# Altium schematic sheet MCU-TFCARD.SchDoc
size B
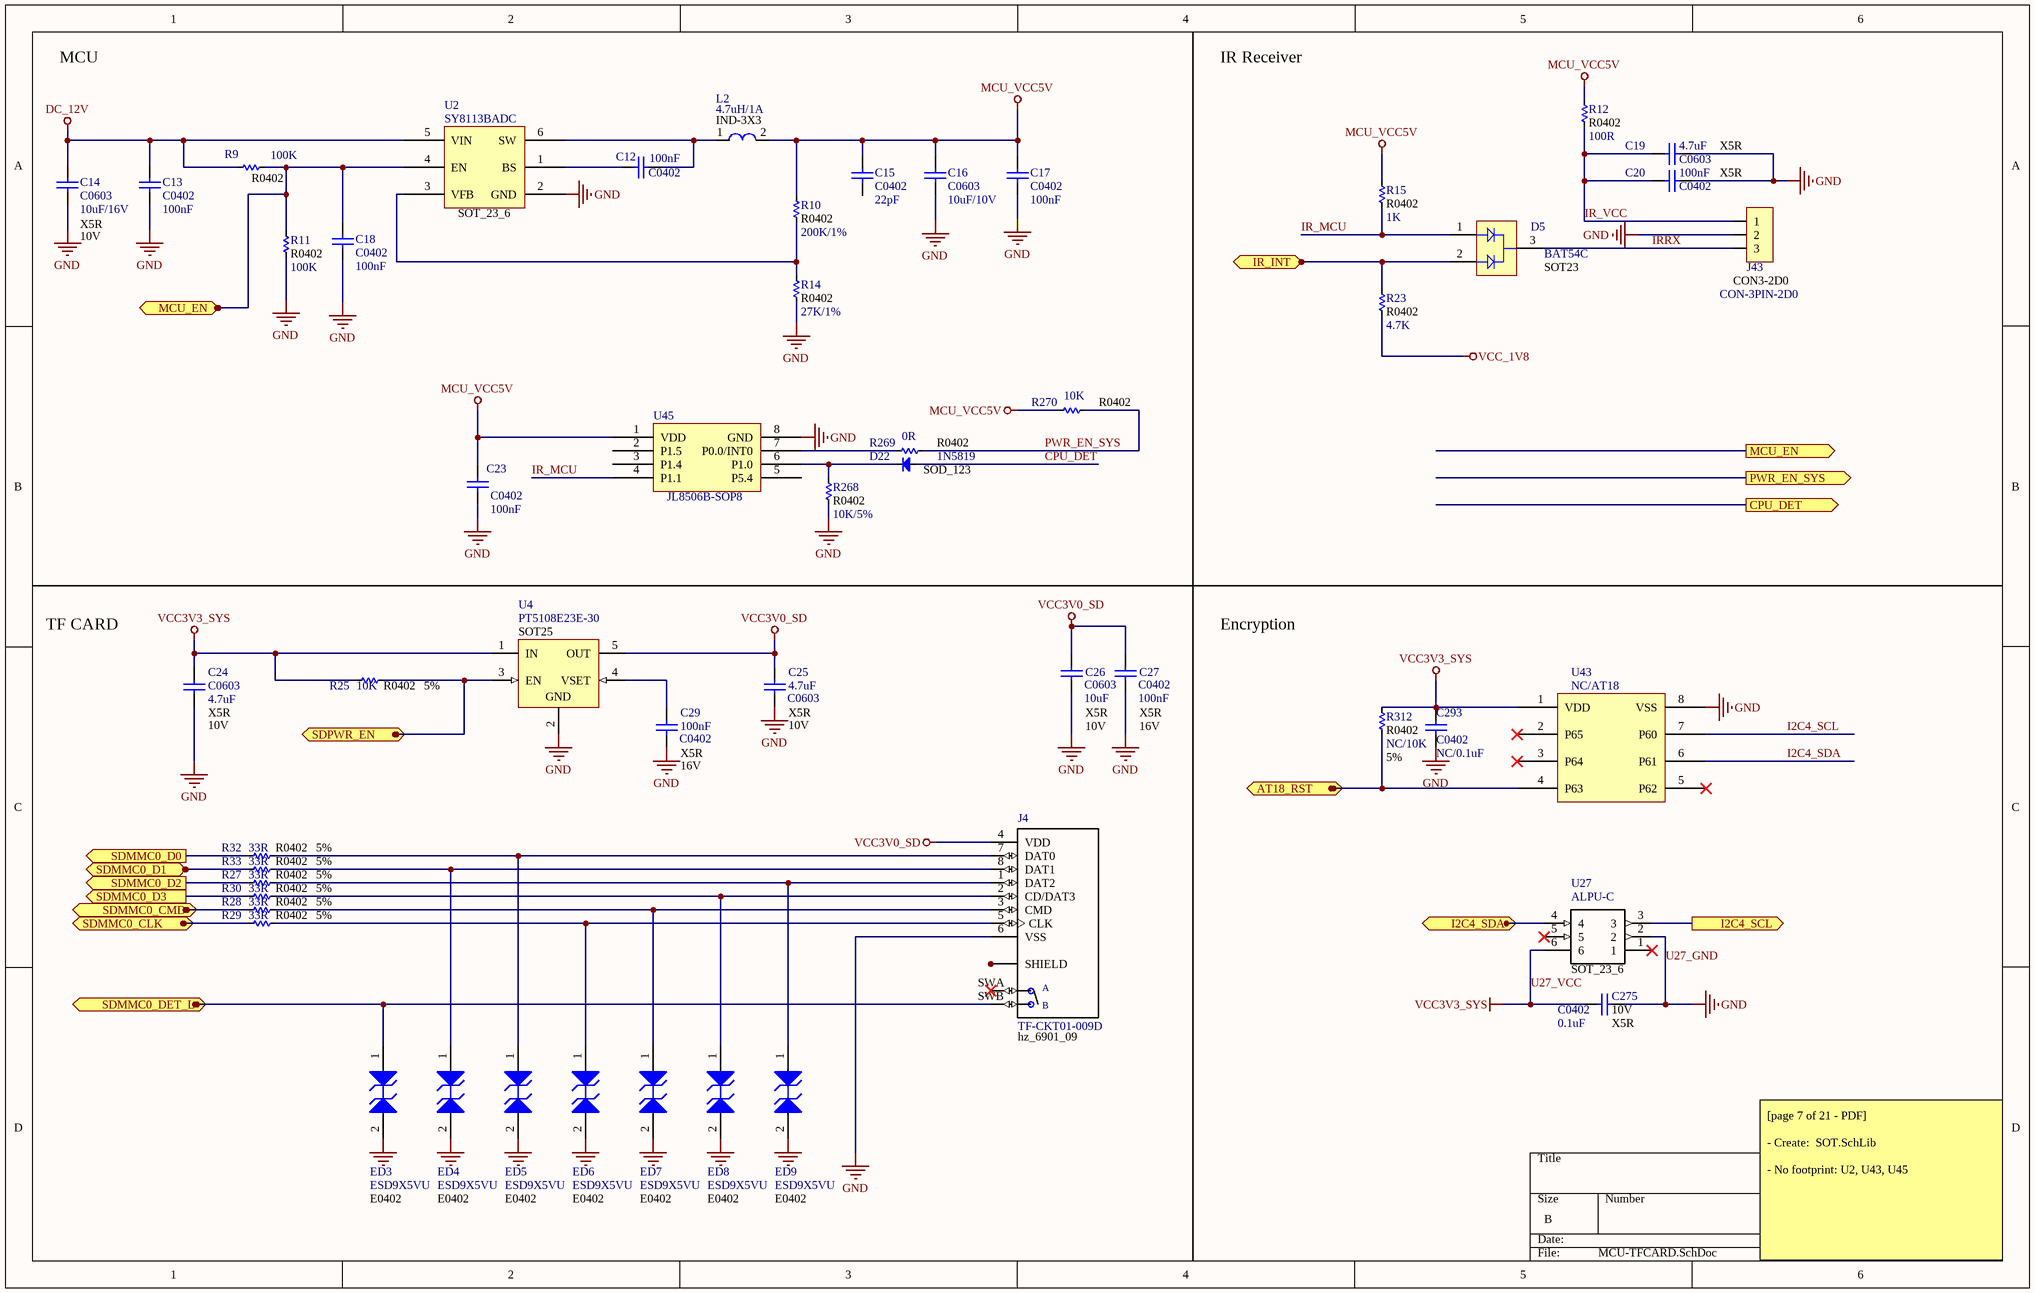
[diagram p0: MCU-TFCARD.SchDoc]

## Parts
C12  C0402  value 100nF  [C 0402]
C13  C0402  value 100nF  [C 0402]
C14  C0603  value 10uF/16V  [C 0603]
C15  C0402  value 22pF  [C 0402]
C16  C0603  value 10uF/10V  [C 0603]
C17  C0402  value 100nF  [C 0402]
C18  C0402  value 100nF  [C 0402]
C19  C0603  value 4.7uF  [C 0603]
C20  C0402  value 100nF  [C 0402]
C23  C0402  value 100nF  [C 0402]
C24  C0603  value 4.7uF  [C 0603]
C25  C0603  value 4.7uF  [C 0603]
C26  C0603  value 10uF  [C 0603]
C27  C0402  value 100nF  [C 0402]
C29  C0402  value 100nF  [C 0402]
C275  C0402  value 0.1uF  [C 0402]
C293  C0402  value NC/0.1uF  [C 0402]
D5  BAT54C  [INF-SOT23_N]
D22  value 1N5819  typr: SOD_123  [DIO-SMD-123]  (hidden comment: Diode SMD)
ED3  ESD9X5VU  size: E0402  [DFN1006-2L]
ED4  ESD9X5VU  size: E0402  [DFN1006-2L]
ED5  ESD9X5VU  size: E0402  [DFN1006-2L]
ED6  ESD9X5VU  size: E0402  [DFN1006-2L]
ED7  ESD9X5VU  size: E0402  [DFN1006-2L]
ED8  ESD9X5VU  size: E0402  [DFN1006-2L]
ED9  ESD9X5VU  size: E0402  [DFN1006-2L]
J4  TF-CKT01-009D  [*HRS_DM3AT-SF-PEJM5_DM3AT-SF-PEJM5(Primary)]
J43  CON-3PIN-2D0  [CON3]
L2  4.7uH/1A  [L-SMD-M-7.3x4.5]
R9  R0402  value 100K  [R 0402]
R10  R0402  value 200K/1%  [R 0402]
R11  R0402  value 100K  [R 0402]
R12  R0402  value 100R  [R 0402]
R14  R0402  value 27K/1%  [R 0402]
R15  R0402  value 1K  [R 0402]
R23  R0402  value 4.7K  [R 0402]
R25  R0402  value 10K  [R 0402]
R27  R0402  value 33R  [R 0402]
R28  R0402  value 33R  [R 0402]
R29  R0402  value 33R  [R 0402]
R30  R0402  value 33R  [R 0402]
R32  R0402  value 33R  [R 0402]
R33  R0402  value 33R  [R 0402]
R268  R0402  value 10K/5%  [R 0402]
R269  R0402  value 0R  [R 0402]
R270  R0402  value 10K  [R 0402]
R312  R0402  value NC/10K  [R 0402]
U2  SOT-23-6_SY8113BADC  [SOT-23-6 Thin]  (value not drawn)
U4  PT5108E23E-30  [TI-DDC5_N]
U27  ALPU-C  [*SSOT6]
U43  NC/AT18  [SOP-8]
U45  SOP-8_JL8506B  [SOP-8]  (value not drawn)

## Ports
AT18_RST (in), CPU_DET (out), I2C4_SCL (out), I2C4_SDA (out), IR_INT (out), MCU_EN (in), MCU_EN (out), PWR_EN_SYS (out), SDMMC0_CLK (out), SDMMC0_CMD (out), SDMMC0_D0 (out), SDMMC0_D1 (out), SDMMC0_D2 (out), SDMMC0_D3 (out), SDMMC0_DET_L (out), SDPWR_EN (in)

## Nets
DC_12V: C13.2 C14.2 R9.2 U2.5(VIN)
MCU_VCC5V: C15.2 C16.2 C17.2 C23.2 L2.2 R10.2 R12.1 R15.1 R270.1 U45.1(VDD)
U27_GND: C13.1 C14.1 C16.1 C17.1 C18.1 C19.1 C20.1 C23.1 C24.1 C25.1 C26.1 C27.1 C29.1 C275.2 C293.1 ED3.2(A2) ED4.2(A2) ED5.2(A2) ED6.2(A2) ED7.2(A2) ED8.2(A2) ED9.2(A2) J4.6(VSS) J43.2 R11.1 R14.2 R268.2 U2.2(GND) U4.2(GND) U27.2 U43.8(VSS) U45.8(GND)  [also labelled GND]
U27_VCC: C24.2 C275.1 C293.2 R25.1 R312.2 U4.1(IN) U27.6 U43.1(VDD)  [also labelled VCC3V3_SYS]
VCC3V0_SD: C25.2 C26.2 C27.2 J4.4(VDD) U4.5(OUT)
VCC_1V8: R23.2
AT18_RST: R312.1 U43.4(P63) ; port AT18_RST
CPU_DET: D22.1(A)
I2C4_SCL: U27.3 ; port I2C4_SCL
I2C4_SCL: U43.7(P60)  [a separate net that carries the same name]
I2C4_SDA: U27.4 ; port I2C4_SDA
I2C4_SDA: U43.6(P61)  [a separate net that carries the same name]
IR_INT: D5.2(A2) R23.1 ; port IR_INT
IR_MCU: D5.1(A1) R15.2 U45.4(P1.1)
IR_VCC: C19.2 C20.2 J43.1 R12.2
IRRX: D5.3(K) J43.3
MCU_EN: C18.2 R9.1 R11.2 U2.4(EN) ; port MCU_EN
PWR_EN_SYS: R269.2 R270.2
SDMMC0_CLK: R29.1 ; port SDMMC0_CLK
SDMMC0_CMD: R28.1 ; port SDMMC0_CMD
SDMMC0_D0: R32.1 ; port SDMMC0_D0
SDMMC0_D1: R33.1 ; port SDMMC0_D1
SDMMC0_D2: R27.1 ; port SDMMC0_D2
SDMMC0_D3: R30.1 ; port SDMMC0_D3
SDMMC0_DET_L: ED3.1(A1) J4.SWB(B) ; port SDMMC0_DET_L
SDPWR_EN: R25.2 U4.3(EN) ; port SDPWR_EN
NetC12_1: C12.1 L2.1 U2.6(SW)
NetC12_2: C12.2 U2.1(BS)
NetC29_2: C29.2 U4.4(VSET)
NetD22_2: D22.2(K) R268.1 U45.6(P1.0)
NetED4_1: ED4.1(A1) J4.8(DAT1) R33.2
NetED5_1: ED5.1(A1) J4.7(DAT0) R32.2
NetED6_1: ED6.1(A1) J4.5(CLK) R29.2
NetED7_1: ED7.1(A1) J4.3(CMD) R28.2
NetED8_1: ED8.1(A1) J4.2(CD/DAT3) R30.2
NetED9_1: ED9.1(A1) J4.1(DAT2) R27.2
NetJ4_P1: J4.P1(SHIELD) J4.P2(SHIELD) J4.P3(SHIELD) J4.P4(SHIELD)
NetR10_1: R10.1 R14.1 U2.3(VFB)
NetR269_1: R269.1 U45.7(P0.0/INT0)

Not connected (* = marked no-connect by the designer): C15 1; J4 SWA(A)*; U27 1* 5*; U43 2(P65)* 3(P64)* 5(P62)*; U45 2(P1.5) 3(P1.4) 5(P5.4)

## Notes on the sheet
- MCU
- IR Receiver
- TF CARD
- Encryption
- [page 7 of 21 - PDF]
  - Create:  SOT.SchLib
  - No footprint: U2, U43, U45
- (in symbol Cap) X5R; 10V; 16V
- (in symbol DM3AT-SF-PEJM5) hz_6901_09
- (in symbol FDC6331L) SOT_23_6
- (in symbol JP3) CON3-2D0
- (in symbol L-SMD-1) IND-3X3
- (in symbol Res-SMD) 5%
- (in symbol SOP-8_JL8506B) JL8506B-SOP8
- (in symbol SOT-23-6_SY8113BADC) SY8113BADC; SOT_23_6
- (in symbol TPS781330220DDCTG4) SOT25

## Library data of the parts
C12-C20 C23-C27 C29 C275 C293 = Cap: Capacitor; Published: 8-Jun-2000; LatestRevisionDate: 17-Jul-2002; LatestRevisionNote: Re-released for DXP Platform.; PackageReference: RAD-0.3; Publisher: Altium Limited; PackageDescription: Radial Cap, Thru-Hole; 2 Leads; 0.3 in Pin Spacing
D5 = BAT54-05: Silicon Schottky Diode, SOT23, Reel, Green; Manufacturer: Infineon; Configuration: Dual; CT (max): 10 pF; Green: TRUE; IF (max): 200 mA; VF (max): 800 mV; VR (max): 30 V; PackageVersion: Apr-08; PackageReference: SOT23; PackageDescription: 3-Pin Small Outline Transistor Package, 1.3 x 2.9 mm Body, 0.95 mm Pitch; Supplier 1: Mouser; Supplier Part Number 1: N/A; Packing: Reel; Mounting Technology: Surface Mount; PartNumber: BAT54-05; ComponentLink1Description: Manufacturer URL; ComponentLink1URL: http://www.infineon.com/; ComponentLink2Description: Datasheet; ComponentLink2URL: http://www.infineon.com/dgdl/bat54series.pdf?folderId=db3a30431400ef68011425f1ca2505e3&fileId=db3a304314dca3890115190b74210ea6; ComponentLink3Description: Package Specification; ComponentLink3URL: http://www.infineon.com/dgdl/SOT23-Package_Overview.pdf?folderId=db3a30431936bc4b0119532290053c66&fileId=db3a30431936bc4b0119533468123c85
D22 = Diode SMD: Default Diode; Code - JEDEC: DO-214-AB; Published: 8-Jun-2000; Revision: July-2002: Re-released for DXP Platform.; Publisher: Altium Limited
ED3-ED9 = 1SMB54CAT3: 600 W Peak Power Zener Transient Voltage Suppressor, Bidirectional, 2-Pin SMB, Tape and Reel; Manufacturer: On Semiconductor; IR Max (uA): 5; PPK Max (W): 600; V(BR) Typ (V): 63.16; DatasheetVersion: Rev. A; PackageVersion: Rev. A, 01/2000; PackageReference: SMB-2-403C-01; PackageDescription: 2-Pin Small Molded Package, J-Bend Lead, Body 4.315 x 3.555 mm; Supplier 1: Digi-Key; Supplier Part Number 1: 1SMB54CAT3-ND; Direction: Bidirectional; Packing: Tape and Reel; Mounting Technology: Surface Mount; PartNumber: 1SMB54CAT3; ComponentLink1Description: Manufacturer URL; ComponentLink1URL: http://www.onsemi.com/; ComponentLink2Description: Datasheet; ComponentLink2URL: http://www.onsemi.com/pub_link/Collateral/1SMB10CAT3-D.PDF; ComponentLink3Description: Package Specification; ComponentLink3URL: http://www.onsemi.com/pub_link/Collateral/1SMB10CAT3-D.PDF
J4 = DM3AT-SF-PEJM5: DM3 RA SMT microSD memory card push/push; MF: Hirose; SnapEDA_Link: https://www.snapeda.com/parts/DM3AT-SF-PEJM5/Hirose%20Electric%20Co%20Ltd/view-part/?ref=snap; MP: DM3AT-SF-PEJM5; Package: None; Price: None; Availability: Unavailable; Value: *
J43 = JP3: WR-PHD 2.54 mm Angled Socket Header; Manufacturer: W¨¹rth Elektronik eiSos GmbH; partNo: 613003143121; ComponentLink1 Description: Manufacturer; ComponentLink2 Description: Datasheet; NoPins: 03; Created Date: 29 March 2013; ComponentLink1URL: http://www.we-online.com; ComponentLink2URL: http://katalog.we-online.de/em/datasheet/6130xx143121.pdf; Created by: Karrer Zheng
L2 = L-SMD-1: partNo: 78477010; Manufacturer: Wurth Elektronik; Inductance: 1.0 μH; ComponentLink1Description: Manufacturer; ComponentLink1URL: http://www.we-online.de; Created by: Baojun Chen; Created Date: Nov.2015; ComponentLink2Description: Datasheet; ComponentLink2URL: http://katalog.we-online.de/pbs/datasheet/78477010.pdf
R9-R12 R14 R15 R23 R25 R27-R30 R32 R33 R268-R270 R312 = Res-SMD: Resistor; Manufacturer: Generic Components; Class: Passive; Published: 08/06/2000; Publisher: Altium Hobart Technology Centre
U2 = SOT-23-6_SY8113BADC: Switching Voltage Regulators 17 Vin,3A Sync SD Reg; Manufacturer: Texas Instruments; Manufacturer Part Number: TPS563200DDCR; Operating Supply Current: 190 uA; Supplier 1: Mouser; RoHS: RoHS Compliant; Category: Switching Voltage Regulators; Stock 1: 18637; Pricing 1: 1=1.44, 10=1.23, 100=0.947, 500=0.836, 1000=0.660, 3000=0.586, 9000=0.564 (USD); Height: 1.1 mm; Length: 2.9 mm; Operating Temperature Range: - 40 C to + 125 C; Package / Case: SOT-23-Thin-6; Packaging: Cut Tape; Series: TPS563200; Width: 1.6 mm; Brand: Texas Instruments; Mounting Style: SMD/SMT; Maximum Operating Temperature: + 125 C; Minimum Operating Temperature: - 40 C; Product Type: Switching Voltage Regulators; Standard Pack Qty: 3000; Subcategory: PMIC - Power Management ICs; RoHS - Mouser: Y; Minimum Order Quantity: 1; Reeling: True
U4 = TPS781330220DDCTG4: Single Output Dual Level Fixed LDO, 150 mA, Fixed 2.2, 3.3 V Output, 2.2 to 5.5 V Input, with Vset Pin, 5-pin SOT (DDC), -40 to 125 degC, Green (RoHS & no Sb/Br); Manufacturer: Texas Instruments; Accuracy(%): 3; Fixed Output Options(V): 3.3; Iout(Max)(A): 0.15; Iq(Typ)(mA): 0.001; SubFamily: Single Channel LDO; Vdo(Typ)(mV): 200; Vin(Max)(V): 5.5; Vin(Min)(V): 2.2; DatasheetVersion: SBVS102B; PackageVersion: 4204403-2/E; PackageReference: DDC5; PackageDescription: 5-Pin Plastic Small Outline, Body 2.9 x 1.6 mm, 0.95 mm Pitch; Supplier 1: Digi-Key; Supplier Part Number 1: TPS781330220DDCTG4-ND; Supplier 2: Mouser; Supplier Part Number 2: 595-S781330220DDCTG4; Eco-Plan: Green (RoHS & no Sb/Br); Vout Adj(Max)(V): 3.3; Vout Adj(Min)(V): 3.3; Mounting Technology: Surface Mount; Code_JEDEC: MO-193; PartNumber: TPS781330220DDCTG4; ComponentLink1Description: Manufacturer URL; ComponentLink1URL: http://www.ti.com/; ComponentLink2Description: Datasheet; ComponentLink2URL: http://www.ti.com/general/docs/lit/getliterature.tsp?genericPartNumber=TPS781330220&fileType=pdf; ComponentLink3Description: Package Specification; ComponentLink3URL: http://www.ti.com/litv/pdf/mpds123d
U27 = FDC6331L: FDC6331 Series 8 V 2.8 A High Side Integrated Load Switch - SSOT-6; MF: ON Semiconductor; Availability: Unavailable; Package: TSOT-23-6 ON Semiconductor; Price: None; SnapEDA_Link: https://www.snapeda.com/parts/FDC6331L/ON%20Semiconductor/view-part/?ref=snap; MP: FDC6331L; Value: *
U43 = SOP8_AT18